# Altium schematic sheet Test_Board.SchDoc: Test Board
size 292 x 193 mm; ProjectRevision: v1.0.0; Author: AUTHOR; Revision: v1.0.0
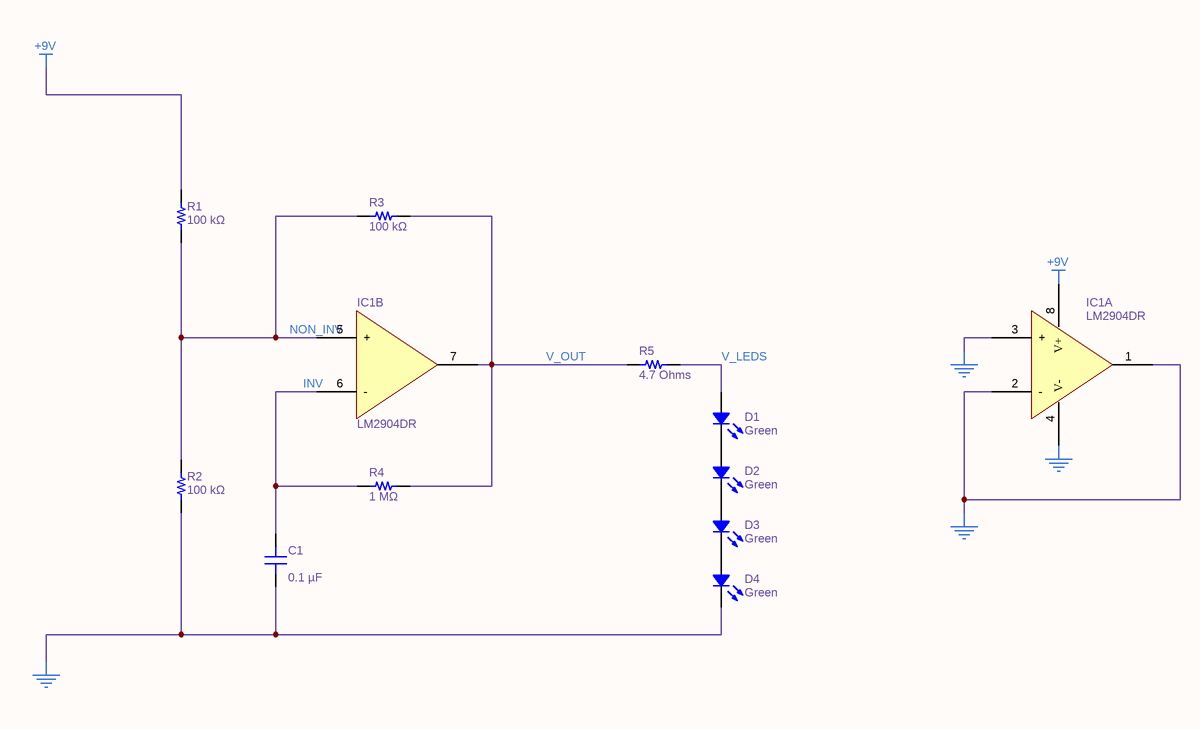
[diagram p0: Test_Board.SchDoc]

## Parts
C1  0.1 µF  [MURATA GRM21B 0805_2012]
D1  Green  [LED 0805_2012 GREEN]
D2  Green  [LED 0805_2012 GREEN]
D3  Green  [LED 0805_2012 GREEN]
D4  Green  [LED 0805_2012 GREEN]
IC1  LM2904DR  [TI SOIC-8 D]  (parts A,B of 2)
R1  100 kΩ  [YAGEO RES 0805_2012]
R2  100 kΩ  [YAGEO RES 0805_2012]
R3  100 kΩ  [YAGEO RES 0805_2012]
R4  1 MΩ  [YAGEO RES 0805_2012]
R5  4.7 Ohms  [YAGEO RES 0805_2012]

## Nets
+9V: IC1.8(V+) R1.1
GND: C1.1 D4.2 IC1.1(OUTA) IC1.2(-) IC1.3(+) IC1.4(V-) R2.2
INV: C1.2 IC1.6(-) R4.1
NON_INV: IC1.5(+) R1.2 R2.1 R3.1
V_LEDS: D1.1 R5.2
V_OUT: IC1.7(OUTB) R3.2 R4.2 R5.1
NetD1_2: D1.2 D2.1
NetD2_2: D2.2 D3.1
NetD3_2: D3.2 D4.1

## Notes on the sheet
- Project
- P4P #83
- Document
- Project Revision
- Date
- Time
- Document Revision
- Sheet
- of
- Revision
- File

## Library data of the parts
C1 = GRM21B7U1A104JA01L: CAP CER 0.1UF 10V U2J 0805; manufacturer: Murata Electronics; Tolerance: ±5%; Part Number: GRM21B7U1A104JA01L; Capacitance: 0.1 µF; Applications: General Purpose; componentlink1description: Datasheet; componentlink1url: https://search.murata.co.jp/Ceramy/image/img/A01X/G101/ENG/GRM21B7U1A104JA01-01.pdf; componentlink2description: DigiKey Link; componentlink2url: https://www.digikey.com/en/products/detail/murata-electronics/GRM21B7U1A104JA01L/2546740; Device Package: 0805 (2012 Metric); lastupdated: 27/08/2024 9:29:55 am; Lifecycle Status: Active; Minimum Order: 1; Mounting Type: Surface Mount, MLCC; Operating Temperature: -55°C ~ 125°C; Package / Case: 0805 (2012 Metric); packaging: TapeAndReel; partid: 16804; Part Status: Active; price: 0.06; series: GRM; Size / Dimension: 0.079" L x 0.049" W (2.00mm x 1.25mm); Supplier 1: DigiKey; Supplier Part Number 1: 490-11592-1-ND; Temperature Coefficient: U2J; Thickness (Max): 0.053" (1.35mm); value: 0.1 µF; Voltage - Rated: 10V
D1-D4 = LTST-C170KGKT: LED GREEN CLEAR SMD; Manufacturer: Lite-On Inc.; Configuration: Standard; Current - Test: 20mA; Lens Color: Colorless; Lens Size: 1.40mm x 1.25mm; Lens Style: Rectangle with Flat Top; Millicandela Rating: 35mcd; Viewing Angle: 130°; Voltage - Forward (Vf) (Typ): 2V; Wavelength - Dominant: 571nm; Wavelength - Peak: 574nm; Part Number: LTST-C170KGKT; Color: Green; ComponentLink1Description: Datasheet; ComponentLink1URL: http://optoelectronics.liteon.com/upload/download/DS22-2000-073/LTST-C170KGKT.pdf; ComponentLink2Description: DigiKey Link; ComponentLink2URL: http://digikey.com/product-detail/en/lite-on-inc/LTST-C170KGKT/160-1414-1-ND/386776; Device Package: 0805 (2012 Metric); Height (Max): 1.10mm; LastUpdated: 3/06/2024 8:00:29 pm; Lens Transparency: Clear; Lifecycle Status: Active; Minimum Order: 1; Mounting Type: Surface Mount; Package / Case: 0805 (2012 Metric); Packaging: TapeAndReel; PartId: 285; Part Status: Active; Price: 0.06; Series: -; Size / Dimension: 2.00mm L x 1.25mm W; Supplier 1: DigiKey; Supplier Part Number 1: 160-1414-1-ND; Value: Green
IC1 = LM2904DR: IC OPAMP GP 2 CIRCUIT 8SOIC; Manufacturer: Texas Instruments; Amplifier Type: General Purpose; Current - Input Bias: 20nA; Current - Output / Channel: 30mA; Current - Supply: 1mA; Gain Bandwidth Product: 700kHz; Number of Circuits: 2; Slew Rate: 0.3V/µs; Voltage - Input Offset: 3mV; Voltage - Supply, Single/Dual (±): 3V ~ 26V, ±1.5V ~ 13V; Part Number: LM2904DR; ComponentLink1Description: Datasheet; ComponentLink1URL: http://www.ti.com/general/docs/suppproductinfo.tsp?distId=10&gotoUrl=http%3A%2F%2Fwww.ti.com%2Flit%2Fgpn%2Flm258a; ComponentLink2Description: DigiKey Link; ComponentLink2URL: http://digikey.com/product-detail/en/texas-instruments/LM2904DR/296-14596-1-ND/555533; Device Package: 8-SOIC (0.154", 3.90mm Width); LastUpdated: 9/01/2020 2:06:28 am; Lifecycle Status: Active; Minimum Order: 1; Mounting Type: Surface Mount; Operating Temperature: -40°C ~ 125°C; Package / Case: 8-SOIC (0.154", 3.90mm Width); Packaging: ReReel; PartId: 4; Part Status: Active; Price: 0.00; Series: -; Supplier 1: DigiKey; Supplier Part Number 1: 296-14596-1-ND; Supplier Device Package: 8-SOIC
R1-R3 = RT0805DRD07100KL: RES SMD 100K OHM 0.5% 1/8W 0805; Manufacturer: Yageo; Power (Watts): 0.125W, 1/8W; Resistance: 100 kOhms; Temperature Coefficient: ±25ppm/°C; Part Number: RT0805DRD07100KL; Value: 100 kΩ; ComponentLink1Description: Datasheet; ComponentLink1URL: https://www.yageo.com/upload/media/product/productsearch/datasheet/rchip/PYu-RT_1-to-0.01_RoHS_L_11.pdf; ComponentLink2Description: DigiKey Link; ComponentLink2URL: https://www.digikey.com/en/products/detail/yageo/RT0805DRD07100KL/1077803; Composition: Thin Film; Device Package: 0805 (2012 Metric); Height - Seated (Max): 0.024" (0.60mm); LastUpdated: 25/07/2024 9:20:26 am; Lifecycle Status: Active; Minimum Order: 1; Number of Terminations: 2; Operating Temperature: -55°C ~ 155°C; Package / Case: 0805 (2012 Metric); Packaging: TapeAndReel; PartId: 30285; Part Status: Active; Price: 0.02; Series: RT; Size / Dimension: 0.079" L x 0.049" W (2.00mm x 1.25mm); Supplier 1: DigiKey; Supplier Part Number 1: 311-2697-1-ND; Supplier Device Package: 0805; Tolerance: ±0.5%
R4 = RT0805BRD071ML: RES SMD 1M OHM 0.1% 1/8W 0805; Manufacturer: Yageo; Power (Watts): 0.125W, 1/8W; Resistance: 1 MOhms; Temperature Coefficient: ±25ppm/°C; Part Number: RT0805BRD071ML; Value: 1 MΩ; ComponentLink1Description: Datasheet; ComponentLink1URL: https://www.yageo.com/upload/media/product/productsearch/datasheet/rchip/PYu-RT_1-to-0.01_RoHS_L_11.pdf; ComponentLink2Description: DigiKey Link; ComponentLink2URL: https://www.digikey.com/en/products/detail/yageo/RT0805BRD071ML/1075699; Composition: Thin Film; Device Package: 0805 (2012 Metric); Height - Seated (Max): 0.024" (0.60mm); LastUpdated: 25/07/2024 9:20:25 am; Lifecycle Status: Active; Minimum Order: 1; Number of Terminations: 2; Operating Temperature: -55°C ~ 155°C; Package / Case: 0805 (2012 Metric); Packaging: TapeAndReel; PartId: 32165; Part Status: Active; Price: 0.04; Series: RT; Size / Dimension: 0.079" L x 0.049" W (2.00mm x 1.25mm); Supplier 1: DigiKey; Supplier Part Number 1: YAG1821CT-ND; Supplier Device Package: 0805; Tolerance: ±0.1%
R5 = AC0805FR-7W4R7L: RES CHIP 0805; Manufacturer: Yageo; Power (Watts): 0.25W, 1/4W; Temperature Coefficient: ±200ppm/°C; Tolerance: ±1%; Part Number: AC0805FR-7W4R7L; Value: 4.7 Ohms; ComponentLink1Description: Datasheet; ComponentLink1URL: https://www.yageo.com/upload/media/product/productsearch/datasheet/rchip/PYu-AC_51_RoHS_L_10.pdf; ComponentLink2Description: DigiKey Link; ComponentLink2URL: https://www.digikey.com/en/products/detail/yageo/AC0805FR-7W4R7L/21620474; Composition: Thick Film; Device Package: 0805 (2012 Metric); Features: Automotive AEC-Q200, Moisture Resistant; Height - Seated (Max): 0.024" (0.60mm); LastUpdated: 25/07/2024 9:20:03 am; Lifecycle Status: Active; Minimum Order: 1; Number of Terminations: 2; Operating Temperature: -55°C ~ 155°C; Package / Case: 0805 (2012 Metric); Packaging: TapeAndReel; PartId: 88154; Price: 0.01; Ratings: AEC-Q200; Resistance: 4.7 Ohms; Series: AC; Size / Dimension: 0.079" L x 0.049" W (2.00mm x 1.25mm); Supplier 1: DigiKey; Supplier Part Number 1: 13-AC0805FR-7W4R7LCT-ND; Supplier Device Package: 0805